# Altium project Cheapdeck.PrjPcb
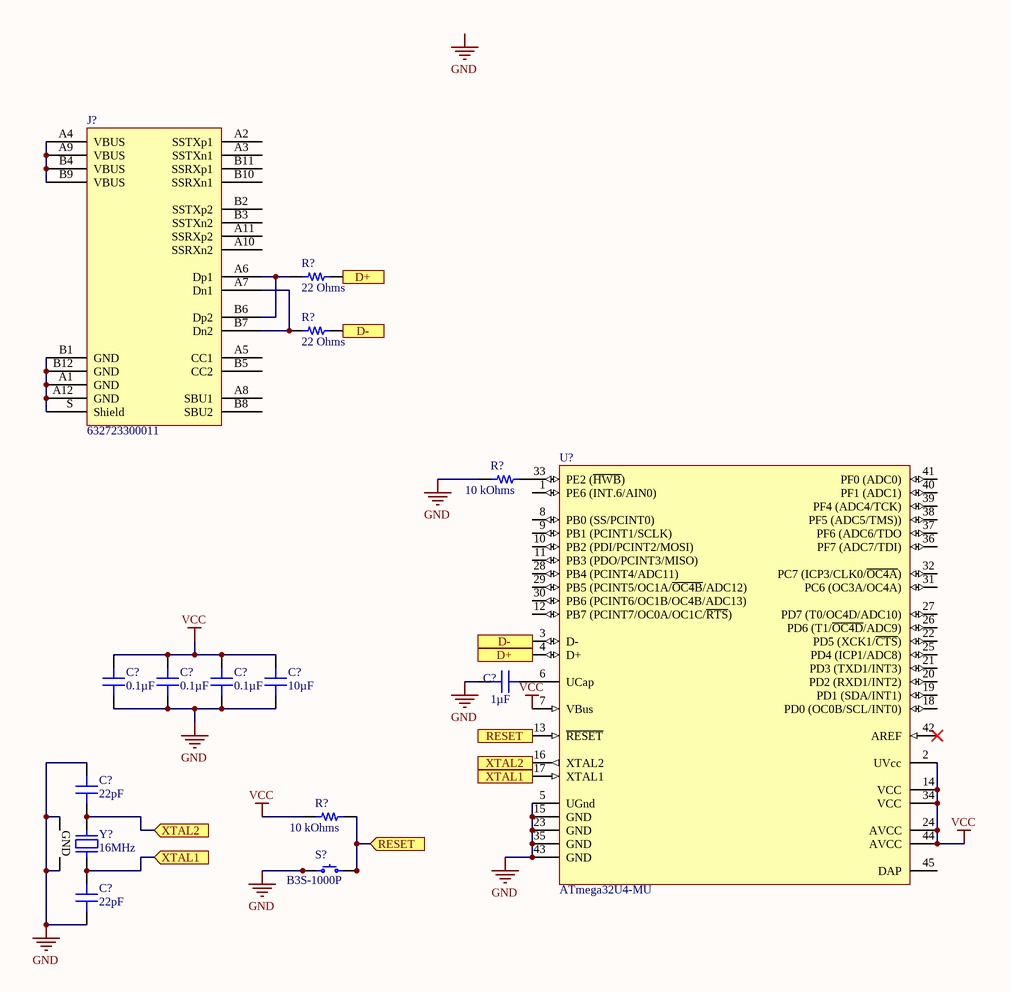
[diagram p0: Cheapdeck.SchDoc]
1 sheet, 15 parts. Net scope: flat (ports and power ports of the same name join across sheets).

## Sheet Cheapdeck.SchDoc
size A3

### Parts
(Parts that share a designator on the sheet are numbered #1, #2 ... from top to bottom, then left to right.)
C?#1  0.1µF  [CAP 0805_2012]
C?#2  0.1µF  [CAP 0805_2012]
C?#3  0.1µF  [CAP 0805_2012]
C?#4  10µF  [CAP 0805_2012]
C?#5  1µF  [CAP 0805_2012]
C?#6  22pF  [CAP 0805_2012]
C?#7  22pF  [CAP 0805_2012]
J?  632723300011  [WURTH 632723300011]
R?#1  22 Ohms  [RES 0805_2012]
R?#2  22 Ohms  [RES 0805_2012]
R?#3  10 kOhms  [RES 0805_2012]
R?#4  10 kOhms  [RES 0805_2012]
S?  B3S-1000P  [OMRON B3S-1000P]
U?  ATmega32U4-MU  [44PW_N]
Y?  16MHz  [NDK NX3225SA]

### Ports
D+ (in), D- (in), RESET (in), XTAL1 (in), XTAL2 (in)

### Nets
GND: C?#1.1 C?#2.1 C?#3.1 C?#4.1 C?#5.1 C?#6.1 C?#7.1 R?#3.2 S?.1 S?.2 U?.5(UGnd) U?.15(GND) U?.23(GND) U?.35(GND) U?.43(GND) Y?.2(GND) Y?.4(GND)
VCC: C?#1.2 C?#2.2 C?#3.2 C?#4.2 R?#4.1 U?.2(UVcc) U?.7(VBus) U?.14(VCC) U?.24(AVCC) U?.34(VCC) U?.44(AVCC)
NetC?#5_2: C?#5.2 U?.6(UCap)
NetC?#6_2: C?#6.2 U?.16(XTAL2) Y?.1 ; port XTAL2
NetC?#7_2: C?#7.2 U?.17(XTAL1) Y?.3 ; port XTAL1
NetJ?_A1: J?.A1(GND) J?.A12(GND) J?.B1(GND) J?.B12(GND) J?.S(Shield)
NetJ?_A4: J?.A4(VBUS) J?.A9(VBUS) J?.B4(VBUS) J?.B9(VBUS)
NetJ?_A6: J?.A6(Dp1) J?.B6(Dp2) R?#1.1
NetJ?_A7: J?.A7(Dn1) J?.B7(Dn2) R?#2.1
NetR?#1_2: R?#1.2 U?.4(D+) ; port D+
NetR?#2_2: R?#2.2 U?.3(D-) ; port D-
NetR?#3_1: R?#3.1 U?.33(PE2_(~{HWB}))
NetR?#4_2: R?#4.2 S?.3 S?.4 U?.13(~{RESET}) ; port RESET

Not connected (* = marked no-connect by the designer): J? A2(SSTXp1) A3(SSTXn1) A5(CC1) A8(SBU1) A10(SSRXn2) A11(SSRXp2) B2(SSTXp2) B3(SSTXn2) B5(CC2) B8(SBU2) B10(SSRXn1) B11(SSRXp1); U? 1(PE6_(INT.6/AIN0)) 8(PB0_(SS/PCINT0)) 9(PB1_(PCINT1/SCLK)) 10(PB2_(PDI/PCINT2/MOSI)) 11(PB3_(PDO/PCINT3/MISO)) 12(PB7_(PCINT7/OC0A/OC1C/~{RTS})) 18(PD0_(OC0B/SCL/INT0)) 19(PD1_(SDA/INT1)) 20(PD2_(RXD1/INT2)) 21(PD3_(TXD1/INT3)) 22(PD5_(XCK1/~{CTS})) 25(PD4_(ICP1/ADC8)) 26(PD6_(T1/~{OC4D}/ADC9)) 27(PD7_(T0/OC4D/ADC10)) 28(PB4_(PCINT4/ADC11)) 29(PB5_(PCINT5/OC1A/~{OC4B}/ADC12)) 30(PB6_(PCINT6/OC1B/OC4B/ADC13)) 31(PC6_(OC3A/OC4A)) 32(PC7_(ICP3/CLK0/~{OC4A})) 36(PF7_(ADC7/TDI)) 37(PF6_(ADC6/TDO) 38(PF5_(ADC5/TMS))) 39(PF4_(ADC4/TCK)) 40(PF1_(ADC1)) 41(PF0_(ADC0)) 42(AREF)* 45(DAP)

### Notes on the sheet
- Labels drawn without touching a wire or pin: GND

### Library data of the parts
C?#1-C?#3 = C0805C104K6RAC7800: CAP CER SMD 0805 .1UF 35V 10% X7; Manufacturer: KEMET; Temperature Coefficient: X7R; Part Number: C0805C104K6RAC7800; Value: 0.1µF; Applications: Bypass, Decoupling; Capacitance: 0.1µF; ComponentLink1Description: Datasheet; ComponentLink1URL: https://api.kemet.com/component-edge/download/datasheet/C0805C104K6RAC7800.pdf; ComponentLink2Description: DigiKey Link; ComponentLink2URL: http://digikey.com/product-detail/en/kemet/C0805C104K6RAC7800/399-17618-1-ND/8572618; Device Package: 0805 (2012 Metric); LastUpdated: 02/09/2020 01:04:08; Lifecycle Status: Active; Minimum Order: 1; Mounting Type: Surface Mount, MLCC; Operating Temperature: -55°C ~ 125°C; Package / Case: 0805 (2012 Metric); Packaging: TapeAndReel; PartId: 17763; Part Status: Active; Price: 0.10; Series: SMD Comm X7R; Size / Dimension: 0.079" L x 0.049" W (2.00mm x 1.25mm); Supplier 1: DigiKey; Supplier Part Number 1: 399-17618-1-ND; Thickness (Max): 0.035" (0.88mm); Tolerance: ±10%; Voltage - Rated: 35V
C?#4 = 885012107014: CAP CER 10UF 16V X5R 0805; Manufacturer: Würth Elektronik; Tolerance: ±20%; Part Number: 885012107014; Value: 10µF; Applications: General Purpose; Capacitance: 10µF; ComponentLink1Description: Datasheet; ComponentLink1URL: https://katalog.we-online.de/pbs/datasheet/885012107014.pdf; ComponentLink2Description: DigiKey Link; ComponentLink2URL: http://digikey.com/product-detail/en/w-rth-elektronik/885012107014/732-7624-1-ND/5454251; Device Package: 0805 (2012 Metric); LastUpdated: 02/09/2020 01:04:37; Lifecycle Status: Active; Minimum Order: 1; Mounting Type: Surface Mount, MLCC; Operating Temperature: -55°C ~ 85°C; Package / Case: 0805 (2012 Metric); Packaging: TapeAndReel; PartId: 5041; Part Status: Active; Price: 0.11; Series: WCAP-CSGP; Size / Dimension: 0.079" L x 0.049" W (2.00mm x 1.25mm); Supplier 1: DigiKey; Supplier Part Number 1: 732-7624-1-ND; Temperature Coefficient: X5R; Thickness (Max): 0.057" (1.45mm); Voltage - Rated: 16V
C?#5 = 885012107015: CAP CER 1UF 25V X5R 0805; Manufacturer: Würth Elektronik; Tolerance: ±20%; Part Number: 885012107015; Value: 1µF; Applications: General Purpose; Capacitance: 1µF; ComponentLink1Description: Datasheet; ComponentLink1URL: https://katalog.we-online.de/pbs/datasheet/885012107015.pdf; ComponentLink2Description: DigiKey Link; ComponentLink2URL: http://digikey.com/product-detail/en/w-rth-elektronik/885012107015/732-7625-1-ND/5454252; Device Package: 0805 (2012 Metric); LastUpdated: 02/09/2020 01:04:29; Lifecycle Status: Active; Minimum Order: 1; Mounting Type: Surface Mount, MLCC; Operating Temperature: -55°C ~ 85°C; Package / Case: 0805 (2012 Metric); Packaging: TapeAndReel; PartId: 9390; Part Status: Active; Price: 0.05; Series: WCAP-CSGP; Size / Dimension: 0.079" L x 0.049" W (2.00mm x 1.25mm); Supplier 1: DigiKey; Supplier Part Number 1: 732-7625-1-ND; Temperature Coefficient: X5R; Thickness (Max): 0.053" (1.35mm); Voltage - Rated: 25V
C?#6 C?#7 = 885012007012: CAP CER 22PF 16V C0G/NP0 0805; Manufacturer: Würth Elektronik; Temperature Coefficient: C0G, NP0; Tolerance: ±5%; Part Number: 885012007012; Value: 22pF; Applications: General Purpose; Capacitance: 22pF; ComponentLink1Description: Datasheet; ComponentLink1URL: https://katalog.we-online.de/pbs/datasheet/885012007012.pdf; ComponentLink2Description: DigiKey Link; ComponentLink2URL: http://digikey.com/product-detail/en/w-rth-elektronik/885012007012/732-7816-1-ND/5454443; Device Package: 0805 (2012 Metric); LastUpdated: 02/09/2020 01:04:25; Lifecycle Status: Active; Minimum Order: 1; Mounting Type: Surface Mount, MLCC; Operating Temperature: -55°C ~ 125°C; Package / Case: 0805 (2012 Metric); Packaging: TapeAndReel; PartId: 11782; Part Status: Active; Price: 0.03; Series: WCAP-CSGP; Size / Dimension: 0.079" L x 0.049" W (2.00mm x 1.25mm); Supplier 1: DigiKey; Supplier Part Number 1: 732-7816-1-ND; Thickness (Max): 0.028" (0.70mm); Voltage - Rated: 16V
J? = 632723300011: CONN RCP USB3.1 TYPEC 24P SMD RA; Manufacturer: Würth Elektronik; Connector Type: USB - C (Type - C); Current Rating (Amps): 5A; Gender: Receptacle; Mating Cycles: 10000; Number of Contacts: 24; Number of Ports: 1; Shielding: Unshielded; Specifications: USB 3.1 (USB 3.1 Gen 2, Superspeed+); Voltage - Rated: 20VDC; Part Number: 632723300011; ComponentLink1Description: Datasheet; ComponentLink1URL: https://katalog.we-online.de/em/datasheet/632723x00011.pdf; ComponentLink2Description: DigiKey Link; ComponentLink2URL: http://digikey.com/product-detail/en/w-rth-elektronik/632723300011/732-9618-1-ND/5806673; LastUpdated: 24/05/2020 22:36:40; Lifecycle Status: Active; Minimum Order: 1; Mounting Feature: Horizontal; Mounting Type: Surface Mount, Right Angle; Through Hole; Operating Temperature: -40°C ~ 105°C; Packaging: TapeAndReel; Part Status: Active; Price: 2.95; Series: WR-COM; Supplier 1: DigiKey; Supplier Part Number 1: 732-9618-1-ND; Termination: Solder
R?#1 R?#2 = ERJ-P06F22R0V: RES SMD 22 OHM 1% 1/2W 0805; Manufacturer: Panasonic Electronic Components; Power (Watts): 0.5W, 1/2W; Temperature Coefficient: ±300ppm/°C; Part Number: ERJ-P06F22R0V; Value: 22 Ohms; ComponentLink1Description: Datasheet; ComponentLink1URL: https://industrial.panasonic.com/cdbs/www-data/pdf/RDO0000/AOA0000C331.pdf; ComponentLink2Description: DigiKey Link; ComponentLink2URL: http://digikey.com/product-detail/en/panasonic-electronic-components/ERJ-P06F22R0V/P16066CT-ND/3982413; Composition: Thick Film; Device Package: 0805 (2012 Metric); Features: Automotive AEC-Q200, Pulse Withstanding; Height - Seated (Max): 0.028" (0.70mm); LastUpdated: 02/09/2020 01:14:52; Lifecycle Status: Active; Minimum Order: 1; Number of Terminations: 2; Operating Temperature: -55°C ~ 155°C; Package / Case: 0805 (2012 Metric); Packaging: TapeAndReel; PartId: 42239; Part Status: Active; Price: 0.02; Ratings: AEC-Q200; Resistance: 22 Ohms; Series: ERJ; Size / Dimension: 0.079" L x 0.049" W (2.00mm x 1.25mm); Supplier 1: DigiKey; Supplier Part Number 1: P16066CT-ND; Supplier Device Package: 0805; Tolerance: ±1%
R?#3 R?#4 = ERJ-P06F1002V: RES SMD 10K OHM 1% 1/2W 0805; Manufacturer: Panasonic Electronic Components; Power (Watts): 0.5W, 1/2W; Temperature Coefficient: ±100ppm/°C; Part Number: ERJ-P06F1002V; Value: 10 kOhms; ComponentLink1Description: Datasheet; ComponentLink1URL: https://industrial.panasonic.com/cdbs/www-data/pdf/RDO0000/AOA0000C331.pdf; ComponentLink2Description: DigiKey Link; ComponentLink2URL: http://digikey.com/product-detail/en/panasonic-electronic-components/ERJ-P06F1002V/P16059CT-ND/3982406; Composition: Thick Film; Device Package: 0805 (2012 Metric); Features: Automotive AEC-Q200, Pulse Withstanding; Height - Seated (Max): 0.028" (0.70mm); LastUpdated: 02/09/2020 01:14:52; Lifecycle Status: Active; Minimum Order: 1; Number of Terminations: 2; Operating Temperature: -55°C ~ 155°C; Package / Case: 0805 (2012 Metric); Packaging: TapeAndReel; PartId: 42230; Part Status: Active; Price: 0.02; Ratings: AEC-Q200; Resistance: 10 kOhms; Series: ERJ; Size / Dimension: 0.079" L x 0.049" W (2.00mm x 1.25mm); Supplier 1: DigiKey; Supplier Part Number 1: P16059CT-ND; Supplier Device Package: 0805; Tolerance: ±1%
S? = B3S-1000P: SWITCH TACTILE SPST-NO 0.05A 24V; Manufacturer: Omron Electronics Inc-EMC Div; Actuator Height off PCB, Vertical: 4.30mm; Actuator Orientation: Top Actuated; Actuator Type: Standard; Contact Rating @ Voltage: 0.05A @ 24VDC; Illumination: Non-Illuminated; Ingress Protection: IP67 - Dust Tight, Waterproof; Operating Force: 160gf; Outline: 6.60mm x 6.00mm; Switch Function: Off-Mom; Part Number: B3S-1000P; Circuit: SPST-NO; ComponentLink1Description: Datasheet; ComponentLink1URL: https://omronfs.omron.com/en_US/ecb/products/pdf/en-b3s.pdf; ComponentLink2Description: DigiKey Link; ComponentLink2URL: http://digikey.com/product-detail/en/omron-electronics-inc-emc-div/B3S-1000P/SW836CT-ND/700012; Features: Sealed - Fully; LastUpdated: 09/04/2020 09:57:13; Lifecycle Status: Active; Minimum Order: 1; Mounting Type: Surface Mount; Operating Temperature: -25°C ~ 70°C; Packaging: TapeAndReel; Part Status: Active; Price: 0.39; Series: B3S; Supplier 1: DigiKey; Supplier Part Number 1: SW836CT-ND; Termination Style: Gull Wing
U? = ATmega32U4-MU: 8-bit AVR Microcontroller, 2.7-5.5V, 32KB Flash, 2.5KB EEPROM, 1KB SRAM, USB Controller, 44-pin QFN, Industrial Grade (-40°C to 85°C); Published: 1-Apr-2010; DatasheetVersion: revD, Jan-2009; PackageVersion: revF, Jul-2007; PackageReference: 44PW; Publisher: Altium Limited; PackageDescription: 44-Pin Quad Flat No-Lead Package, 7 x 7 mm Body, 0.5 mm Pitch (QFN); Supplier 1: Digi-Key; Supplier Part Number 1: ATMEGA32U4-MU-ND; Supplier 2: Mouser; Supplier Part Number 2: 556-ATMEGA32U4-MU; Code_JEDEC: MO-220-VKKD-1; ComponentLink1Description: Manufacturer Link; ComponentLink1URL: http://www.atmel.com/products/avr/default.asp?; ComponentLink2Description: ATmega16U4/32U4 Datasheet; ComponentLink2URL: http://www.atmel.com/dyn/resources/prod_documents/doc7766.pdf; ComponentLink3Description: ATmega16U4 ATmega32U4 Summary; ComponentLink3URL: http://www.atmel.com/dyn/resources/prod_documents/7766S.pdf; ComponentLink4Description: Atmel.com Home; ComponentLink4URL: http://www.atmel.com
Y? = NX3225SA-16.000000MHZ-T1: CRYSTAL 16.0000MHZ 10PF SMD; Manufacturer: NDK America, Inc.; ESR (Equivalent Series Resistance): 60 Ohms; Frequency Stability: ±10ppm; Operating Mode: Fundamental; Part Number: NX3225SA-16.000000MHZ-T1; ComponentLink1Description: Datasheet; ComponentLink1URL: //media.digikey.com/pdf/Data Sheets/NDK PDFs/NX3225SA-16.000000MHz-T1.pdf; ComponentLink2Description: DigiKey Link; ComponentLink2URL: http://digikey.com/product-detail/en/ndk-america-inc/NX3225SA-16.000000MHZ-T1/644-1100-1-ND/1468361; Frequency: 16MHz; Frequency Tolerance: ±10ppm; Height - Seated (Max): 0.028" (0.70mm); LastUpdated: 02/09/2020 01:21:59; Lifecycle Status: Active; Load Capacitance: 10pF; Minimum Order: 1; Mounting Type: Surface Mount; Operating Temperature: -20°C ~ 70°C; Package / Case: 4-SMD, No Lead; Packaging: TapeAndReel; PartId: 592; Part Status: Active; Price: 0.47; Series: NX3225SA; Size / Dimension: 0.126" L x 0.098" W (3.20mm x 2.50mm); Supplier 1: DigiKey; Supplier Part Number 1: 644-1100-1-ND; Type: MHz Crystal; Value: 16MHz